# EAGLE design RobotBooster_mini_v1 (EAGLE 6.1)
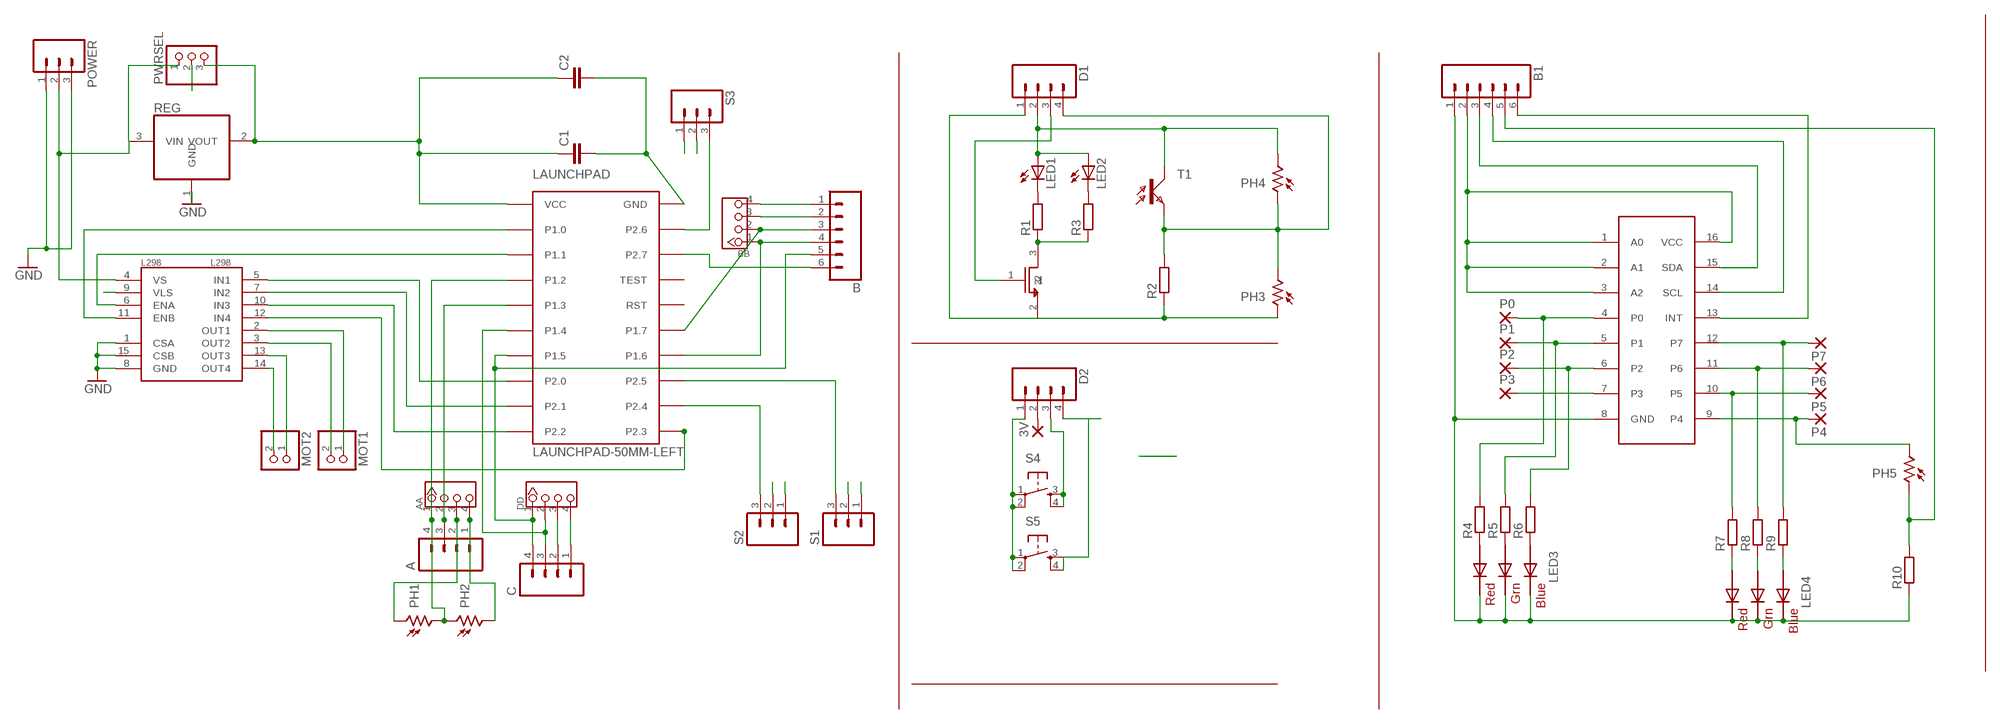
[diagram p0: schematic, sheet 1]

## Parts
3V  1,6/0,8  [1,6/0,8]
A  M04PTH  [1X04]
AA  TWIG-4P-2.0  [4P-2.0-W/O-BUCKLE]
B  M06SIP  [1X06]
B1  M06SIP  [1X06]
BB  TWIG-4P-2.0  [4P-2.0-W/O-BUCKLE]
C  M04PTH  [1X04]
C1  C-EU025-030X050  [C025-030X050]
C2  C-EUC1206  [C1206]
D1  M04PTH  [1X04]
D2  M04PTH  [1X04]
DD  TWIG-4P-2.0  [4P-2.0-W/O-BUCKLE]
FET  2N7002PW  [SOT323-R]
L298  L298  [MULTIWATT15]
LAUNCHPAD  LAUNCHPAD-50MM-LEFT  [LAUNCHPAD-50MM-LEFT]
LED1  LED5MM  [LED5MM]
LED2  LED5MM  [LED5MM]
LED3  RGBLED5050  [RGBLED5050]
LED4  RGBLED5050  [RGBLED5050]
MOT1  PINHD-1X2  [1X02]
MOT2  PINHD-1X2  [1X02]
P0  1,6/0,8  [1,6/0,8]
P1  1,6/0,8  [1,6/0,8]
P2  1,6/0,8  [1,6/0,8]
P3  1,6/0,8  [1,6/0,8]
P4  1,6/0,8  [1,6/0,8]
P5  1,6/0,8  [1,6/0,8]
P6  1,6/0,8  [1,6/0,8]
P7  1,6/0,8  [1,6/0,8]
PH1  M9960_11A  [M9960]
PH2  M9960_11A  [M9960]
PH3  M9960_11A  [M9960]
PH4  M9960_11A  [M9960]
PH5  M9960_11A  [M9960]
POWER  M03LONGPADS  [1X03_LONGPADS]
PWRSEL  PINHD-1X3  [1X03]
R1  R-EU_R1206  [R1206]
R2  R-EU_R1206  [R1206]
R3  R-EU_R1206  [R1206]
R4  R-EU_R0805  [R0805]
R5  R-EU_R0805  [R0805]
R6  R-EU_R0805  [R0805]
R7  R-EU_R0805  [R0805]
R8  R-EU_R0805  [R0805]
R9  R-EU_R0805  [R0805]
R10  R-EU_R0805  [R0805]
REG  REG1117  [SOT223]
S1  M03PTH  [1X03]
S2  M03PTH  [1X03]
S3  M03PTH  [1X03]
S4  TAC_SWITCHPTH  [TACTILE-PTH]
S5  TAC_SWITCHPTH  [TACTILE-PTH]
T1  LPT80A  [LPT80A]
U$1  PCA9534DBR  [SSOP16]

## Nets
GND: A.1 AA.4 B.1 BB.4 C1.2 C2.2 C.1 DD.4 L298.1(CSA) L298.8(GND) L298.15(CSB) LAUNCHPAD.GND PH2.2 POWER.1 POWER.3 REG.1(GND) S1.1 S2.1 S3.1
N$1: L298.14(OUT4) MOT2.2
N$2: L298.13(OUT3) MOT2.1
N$3: L298.3(OUT2) MOT1.2
N$4: L298.2(OUT1) MOT1.1
N$5: D1.1 FET.2 PH3.1 R2.1
N$6: FET.3 R1.1 R3.1
N$7: LED1.K(C) R1.2
N$8: A.4 AA.1 LAUNCHPAD.P1.2 PH1.2 PH2.1
N$9: L298.5(IN1) LAUNCHPAD.P2.0
N$10: C.3 DD.2 LAUNCHPAD.P1.4
N$11: D1.3 FET.1
N$12: D1.4 PH3.2 PH4.1 R2.2 T1.E
N$13: B.3 BB.2 LAUNCHPAD.P1.7
N$14: B.4 BB.1 LAUNCHPAD.P1.6
N$15: A.3 AA.2 LAUNCHPAD.P1.3
N$16: LAUNCHPAD.P2.4 S2.3
N$17: LAUNCHPAD.P2.5 S1.3
N$18: B.5 C.4 DD.1 LAUNCHPAD.P1.5
N$19: D1.2 LED1.A LED2.A PH4.2 T1.C
N$20: LED2.K(C) R3.2
N$21: P6.1(P) R8.2 U$1.11(P6)
N$22: P3.1(P) U$1.7(P3)
N$23: B.6 LAUNCHPAD.P2.7
N$24: D2.1 S4.1 S4.2 S5.1 S5.2
N$25: 3V.1(P) D2.2
N$26: LAUNCHPAD.P2.6 S3.3
N$27: D2.3 S4.3 S4.4
N$28: D2.4 S5.3 S5.4
N$32: B1.2 U$1.1(A0) U$1.2(A1) U$1.3(A2) U$1.16(VCC)
N$33: B1.1 LED3.4(BLUE_C) LED3.5(RED_C) LED3.6(GREEN_C) LED4.4(BLUE_C) LED4.5(RED_C) LED4.6(GREEN_C) R10.1 U$1.8(GND)
N$34: B1.3 U$1.15(SDA)
N$35: B1.4 U$1.14(SCL)
N$36: P7.1(P) R9.2 U$1.12(P7)
N$39: LED3.2(RED_A) R4.1
N$40: LED3.1(GREEN_A) R5.1
N$41: LED3.3(BLUE_A) R6.1
N$42: B1.6 U$1.13(INT)
N$45: LED4.2(RED_A) R7.1
N$46: LED4.1(GREEN_A) R8.1
N$47: LED4.3(BLUE_A) R9.1
N$49: P0.1(P) R4.2 U$1.4(P0)
N$50: P1.1(P) R5.2 U$1.5(P1)
N$51: P2.1(P) R6.2 U$1.6(P2)
N$52: B1.5 PH5.1 R10.2
N$53: P4.1(P) PH5.2 U$1.9(P4)
N$54: P5.1(P) R7.2 U$1.10(P5)
P1.0: L298.11(ENB) LAUNCHPAD.P1.0
P1.1: L298.6(ENA) LAUNCHPAD.P1.1
P1.3: L298.7(IN2) LAUNCHPAD.P2.1
P1.4: L298.10(IN3) LAUNCHPAD.P2.2
P1.5: L298.12(IN4) LAUNCHPAD.P2.3
VBAT: L298.4(VS) POWER.2 PWRSEL.1 REG.3(VIN)
VCC: A.2 AA.3 B.2 BB.3 C1.1 C2.1 C.2 DD.3 L298.9(VLS) LAUNCHPAD.VCC PH1.1 PWRSEL.3 REG.2(VOUT)
VSERV: PWRSEL.2 S1.2 S2.2 S3.2
Unconnected: LAUNCHPAD.RST LAUNCHPAD.TEST

## Library data of the parts
3V P0 P1-P7 = wirepad:1,6/0,8: THROUGH-HOLE PAD
A C D1 D2 = SparkFun-Connectors:M04: Header 4 Standard 4-pin 0.1" header. Use with straight break away headers (SKU : PRT-00116), right angle break away headers (PRT-00553), swiss pins (PRT-00743), machine pins (PRT-00117), and female headers (PRT-00115). Molex polarized connector foot print use with SKU : PRT-08231 with associated crimp pins and housings. 1MM SMD Version SKU: PRT-10208
AA BB DD = Connector:TWIG-4P-2.0
B B1 = SparkFun-Connectors:M06: Header 6 Standard 6-pin 0.1" header. Use with straight break away headers (SKU : PRT-00116), right angle break away headers (PRT-00553), swiss pins (PRT-00743), machine pins (PRT-00117), and female headers (PRT-00115). Molex polarized connector foot print use with SKU : PRT-08094 with associated crimp pins and housings. NOTES ON THE VARIANTS LOCK and LOCK_LONGPADS... This footprint was designed to help hold the alignment of a through-hole component (i.e. 6-pin header) while soldering it into place. You may notice that each hole has been shifted either up or down by 0.005 of an inch from it's more standard position (which is a perfectly straight line). This slight alteration caused the pins (the squares in the middle) to touch the edges of the holes. Because they are alternating, it causes a "brace" to hold the component in place. 0.005 has proven to be the perfect amount of "off-center" position when using our standard breakaway headers. Although looks a little odd when you look at the bare footprint, once you have a header in there, the alteration is very hard to notice. Also, if you push a header all the way into place, it is covered up entirely on the bottom side. This idea of altering the position of holes to aid alignment will be further integrated into the Sparkfun Library for other footprints. It can help hold any component with 3 or more connection pins.
C1 C2 = resistor:C-EU: CAPACITOR, European symbol
FET = apus-spidisplay:2N7002PW
L298 = SparkFun-PowerIC:L298: L298 Dual Full Bridge Driver
LAUNCHPAD = TI_launchpad:LAUNCHPAD: MSP-EXP430G2 LaunchPad Booster Pack layouts. LAUNCHPAD: Full-size board LAUNCHPAD-50MM: 50x50mm board covering the button area LAUNCHPAD-50MM-LEFT: 50x50mm board leaving the button area open. Tall LaunchPad components marked on Reference for reference.
LED1 LED2 = adafruit:LED: LED OSRAM: - CHIPLED LG R971, LG N971, LY N971, LG Q971, LY Q971, LO R971, LY R971 LH N974, LH R974 LS Q976, LO Q976, LY Q976 LO Q996 - Hyper CHIPLED LW Q18S LB Q993, LB Q99A, LB R99A - SideLED LS A670, LO A670, LY A670, LG A670, LP A670 LB A673, LV A673, LT A673, LW A673 LH A674 LY A675 LS A676, LA A676, LO A676, LY A676, LW A676 LS A679, LY A679, LG A679 - Hyper Micro SIDELED® LS Y876, LA Y876, LO Y876, LY Y876 LT Y87S - SmartLED LW L88C, LW L88S LB L89C, LB L89S, LG L890 LS L89K, LO L89K, LY L89K LS L896, LA L896, LO L896, LY L896 - TOPLED LS T670, LO T670, LY T670, LG T670, LP T670 LSG T670, LSP T670, LSY T670, LOP T670, LYG T670 LG T671, LOG T671, LSG T671 LB T673, LV T673, LT T673, LW T673 LH T674 LS T676, LA T676, LO T676, LY T676, LB T676, LH T676, LSB T676, LW T676 LB T67C, LV T67C, LT T67C, LS T67K, LO T67K, LY T67K, LW E67C LS E67B, LA E67B, LO E67B, LY E67B, LB E67C, LV E67C, LT E67C LW T67C LS T679, LY T679, LG T679 LS T770, LO T770, LY T770, LG T770, LP T770 LB T773, LV T773, LT T773, LW T773 LH T774 LS E675, LA E675, LY E675, LS T675 LS T776, LA T776, LO T776, LY T776, LB T776 LHGB T686 LT T68C, LB T68C - Hyper Mini TOPLED® LB M676 - Mini TOPLED Santana® LG M470 LS M47K, LO M47K, LY M47K Source: http://www.osram.convergy.de/
LED3 LED4 = adafruit:RGBLED: For 5050 RGB LEDs, the order of the LEDs may vary from one manufacturer to another!
MOT1 MOT2 = pinhead:PINHD-1X2: PIN HEADER
PH1-PH5 = photo-elements:M9960_11: Photo Sensor Beacon Light, Photometer Applications Source: http://optoelectronics.perkinelmer.com/content/Datasheets/DTS_M9960.pdf
POWER S1-S3 = SparkFun-Connectors:M03: Header 3 Standard 3-pin 0.1" header. Use with straight break away headers (SKU : PRT-00116), right angle break away headers (PRT-00553), swiss pins (PRT-00743), machine pins (PRT-00117), and female headers (PRT-00115). Molex polarized connector foot print use with SKU : PRT-08232 with associated crimp pins and housings.
PWRSEL = adafruit:PINHD-1X3: PIN HEADER
R1-R10 = resistor:R-EU_: RESISTOR, European symbol
REG = burr-brown:REG1117: 800mA and 1A Low Dropout (LDO) Positive Regulator 1.8V, 2.5V, 2.85V, 3.3V, 5V, and Adj; MPN: REG1117; OC_FARNELL: 1097566; OC_NEWARK: 14P6981
S4 S5 = SparkFun-Electromechanical:TAC_SWITCH: Momentary Switch Button commonly used for reset or general input. Spark Fun Electronics SKU : COM-00097
T1 = opto-trans-siemens:LPT80A: PHOTO TRANSISTOR; OC_FARNELL: unknown; OC_NEWARK: unknown
U$1 = apus-spidisplay:PCA9534DBR

## Board
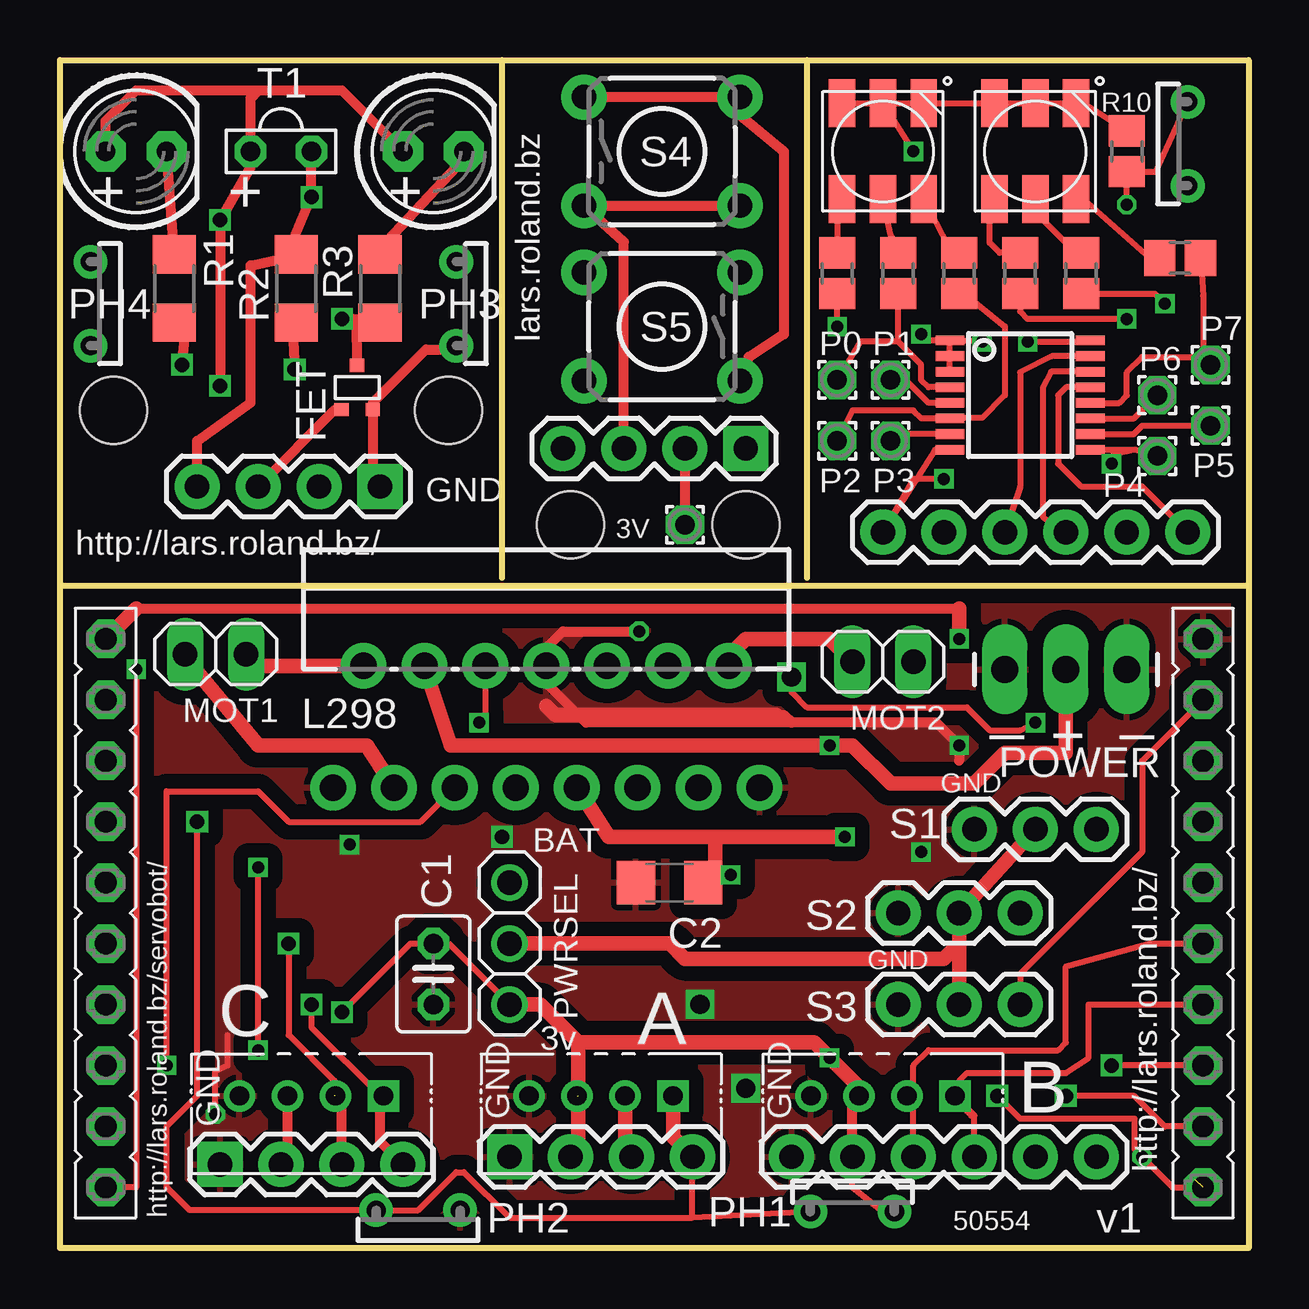
[diagram p1: board, top side]
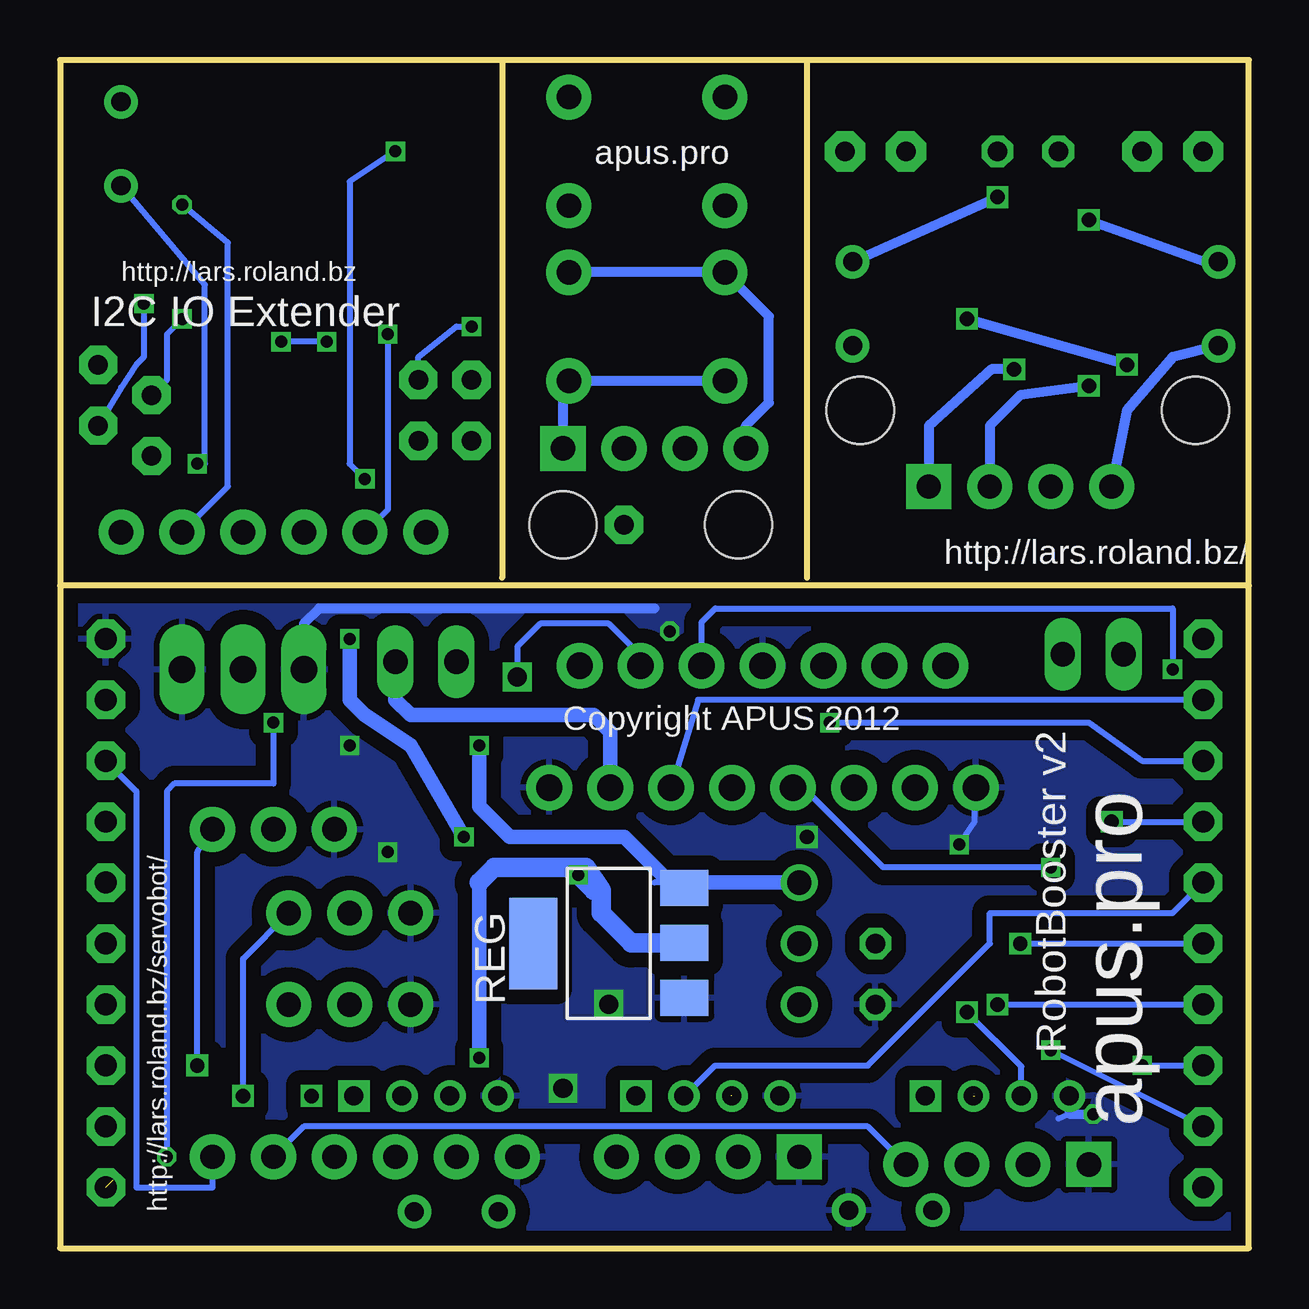
[diagram p2: board, bottom side, seen from below]

Size 49.54 x 49.56 mm. Coordinates in mm from the lower left corner, seen from the top.
Outline: 18.41,49.56 18.41,27.97
Outline: 0,27.65 49.53,27.65
Outline: 0,27.65 0,49.56 31.11,49.56
Outline: 31.11,49.56 49.53,49.56 49.53,27.65
Outline: 49.53,27.65 49.53,0.03 0,0.03 0,27.65
Outline: 31.11,49.56 31.11,27.97
Outline: 0,0 49.54,0 49.54,27.58 0,27.58 0,0
Copper layers (1*16): Top 0.035mm / dielectric 1.5mm / Bottom 0.035mm
Design rules: minimum track width 6mil, minimum drill 12mil, track to track 6mil, track to pad 6mil, pad to pad 6mil, via to via 6mil, smd to smd 0mil, copper to edge 10mil, drill to drill 10mil, minimum pad ring 10mil, minimum via ring 6mil, stop-mask expansion 2mil, vias tented up to drill 100mil, thermal gap 10mil
Holes 2.8 mm at 2.22,34.95 16.19,34.95 21.27,30.19 28.57,30.19

### Footprints (pad centres in the part's own frame; a part is rotated, then mirrored left to right if it is on the bottom)
1,6/0,8 = drill 0.813 pad 1.6 octagon: 1 0,0
1X04 = drill 1.016 pad 1.88 square: 1 0,0 | drill 1.016 pad 1.88: 2 2.54,0; 3 5.08,0; 4 7.62,0
4P-2.0-W/O-BUCKLE = drill 0.8 pad 1.27 square: 1 -3,0 | drill 0.8 pad 1.27: 2 -1,0; 3 1,0; 4 3,0
1X06 = drill 1.016 pad 1.88: 1 0,0; 2 2.54,0; 3 5.08,0; 4 7.62,0; 5 10.16,0; 6 12.7,0
C025-030X050 = drill 0.813 octagon: 1 -1.27,0; 2 1.27,0
C1206 = smd 1.6 x 1.8: 1 -1.4,0; 2 1.4,0
SOT323-R = smd 0.6 x 0.55: 1 -0.65,-0.925; 2 0.65,-0.925; 3 0,0.925
MULTIWATT15 = drill 1.1 pad 1.9: 1 -8.95,-2.39; 2 -7.68,2.69; 3 -6.41,-2.39; 4 -5.14,2.69; 5 -3.87,-2.39; 6 -2.6,2.69; 7 -1.33,-2.39; 8 -0.06,2.69; 9 1.21,-2.39; 10 2.48,2.69; 11 3.75,-2.39; 12 5.02,2.69; 13 6.29,-2.39; 14 7.56,2.69; 15 8.83,-2.39
LAUNCHPAD-50MM-LEFT = drill 0.914 pad 1.6 octagon: GND 24.13,48.26; P1.0 26.67,2.54; P1.1 29.21,2.54; P1.2 31.75,2.54; P1.3 34.29,2.54; P1.4 36.83,2.54; P1.5 39.37,2.54; P1.6 39.37,48.26; P1.7 36.83,48.26; P2.0 41.91,2.54; P2.1 44.45,2.54; P2.2 46.99,2.54; P2.3 46.99,48.26; P2.4 44.45,48.26; P2.5 41.91,48.26; P2.6 26.67,48.26; P2.7 29.21,48.26; RST 34.29,48.26; TEST 31.75,48.26; VCC 24.13,2.54
LED5MM = drill 0.813 pad 1.676 octagon: A -1.27,0; K 1.27,0
RGBLED5050 = smd 2 x 1.1: 1 -2,1.7; 2 -2,0; 3 -2,-1.7; 4 2,-1.7; 5 2,0; 6 2,1.7
1X02 = drill 1.016 long: 1 -1.27,0; 2 1.27,0
M9960 = drill 0.8 pad 1.4: 1 -1.75,0; 2 1.75,0
1X03_LONGPADS = drill 1.118 pad 1.88 long: 1 0,0; 2 2.54,0; 3 5.08,0
1X03 = drill 1.016: 1 -2.54,0; 2 0,0; 3 2.54,0
R1206 = smd 1.6 x 1.803: 1 -1.422,0; 2 1.422,0
R0805 = smd 1.3 x 1.5: 1 -0.85,0; 2 0.85,0
SOT223 = smd 1.499 x 2.007: 1 -2.261,-3.15; 2 0.025,-3.15; 3 2.311,-3.15 | smd 3.81 x 2.007: 4 0,3.15
1X03' = drill 1.016 pad 1.88: 1 0,0; 2 2.54,0; 3 5.08,0
TACTILE-PTH = drill 1.016 pad 1.88: 1 -3.251,2.261; 2 3.251,2.261; 3 -3.251,-2.261; 4 3.251,-2.261
LPT80A = drill 0.813 octagon: C 0,-1.27; E 0,1.27
SSOP16 = smd 0.4 x 1.2: 1 -2.275,-2.925; 2 -1.625,-2.925; 3 -0.975,-2.925; 4 -0.325,-2.925; 5 0.325,-2.925; 6 0.975,-2.925; 7 1.625,-2.925; 8 2.275,-2.925; 9 2.275,2.925; 10 1.625,2.925; 11 0.975,2.925; 12 0.325,2.925; 13 -0.325,2.925; 14 -0.975,2.925; 15 -1.625,2.925; 16 -2.275,2.925

### Placement (x,y rotation side)
3V  26.04,30.19 0 top
A  18.73,3.84 0 top
AA  22.54,6.38 180 top
B  30.48,3.84 0 top
B1  34.29,29.88 0 top
BB  34.29,6.38 180 top
C  6.67,3.52 0 top
C1  15.56,11.46 270 top
C2  25.4,15.27 180 top
D1  13.34,31.78 180 top
D2  28.57,33.37 180 top
DD  10.48,6.38 180 top
FET  12.38,35.91 0 top
L298  20.32,21.62 0 top
LAUNCHPAD  -0.64,49.56 270 top
LED1  3.17,45.75 0 top
LED2  15.56,45.75 0 top
LED3  34.29,45.75 90 top
LED4  40.64,45.75 90 top
MOT1  6.49,24.8 180 top
MOT2  34.29,24.48 180 top
P0  32.39,36.23 0 top
P1  34.61,36.23 0 top
P2  32.39,33.69 0 top
P3  34.61,33.69 0 top
P4  45.72,33.05 0 top
P5  47.94,34.32 0 top
P6  45.72,35.59 0 top
P7  47.94,36.86 0 top
PH1  33.02,1.55 180 top
PH2  14.92,1.62 0 top
PH3  16.51,39.4 90 top
PH4  1.27,39.4 90 top
PH5  46.99,46.07 270 top
POWER  39.37,24.16 0 top
PWRSEL  18.73,12.73 270 top
R1  4.76,40.04 90 top
R2  9.84,40.04 90 top
R3  13.34,40.04 90 top
R4  34.93,40.67 270 top
R5  32.39,40.67 270 top
R6  37.47,40.67 270 top
R7  42.55,40.67 270 top
R8  40.01,40.67 270 top
R9  46.67,41.3 0 top
R10  44.45,45.75 270 top
REG  26.67,12.73 90 bottom
S1  [1X03']  38.1,17.49 0 top
S2  [1X03']  34.93,14 0 top
S3  [1X03']  34.93,10.19 0 top
S4  25.08,45.75 0 top
S5  25.08,38.45 180 top
T1  9.21,45.75 270 top
U$1  40.01,35.59 270 top

### Tracks (layer width: path | path; a pad name or v marks a point on that pad's centre or on a via)
GND  (via drill 0.5, 0.6, 0.8)
  Top 0.254: v6.48,5.62 6.48,7.4 6.99,7.65 6.99,8.92
  Top 0.406: 29.84,22.26 30.16,22.26 30.48,21.94 | 37.47,20.35 v37.47,20.98 36.51,21.94 21.91,21.94 20.32,23.53 20.32,25.11 20.95,25.75 v24.13,25.75
  Top 0.61: 20.26,22.63 20.64,22.26 29.84,22.26
  Bottom 0.254: v12.06,16.86 11.43,17.81 11.43,18.66 L298.1 | 7.48,5.63 7.94,5.43
  Bottom 0.406: DD.4 7.48,5.63 v6.48,5.62 | 24.76,26.7 38.73,26.7 39.37,26.07 POWER.1
  Bottom 0.61: S1.1 38.42,17.49 | 40.01,23.53 POWER.1
  other vias: 18.41,17.18 35.88,16.54 28.57,6.7 26.67,10.19
  pour Bottom (isolate 0.61): 0.95,27.65 49.21,27.65 48.9,0.03 0.64,0.03
  pour Top (isolate 0.61): 0.64,27.65 48.9,27.65 48.9,0.03 0.64,0.03
N$1
  Top 0.61: L298.14 27.88,24.73 28.57,25.43 32.07,25.43 MOT2.2
N$2
  Bottom 0.61: L298.13 26.61,21.56 27.3,22.26 34.93,22.26 35.56,22.89 MOT2.1
N$3
  Top 0.61: MOT1.2 5.21,24.66 8.26,20.98 12.79,20.98 L298.3
N$4
  Top 0.61: L298.2 8.24,24.31 MOT1.1
N$5  (via drill 0.6)
  Top 0.406: R2.1 9.68,38.61 v9.78,36.67 | D1.1 13.03,32.08 FET.2 13.03,35.29 15.24,37.5 16.35,37.5 PH3.1
  Bottom 0.406: v9.78,36.67 10.73,36.67 13.34,34.32 D1.1
N$6  (via drill 0.6)
  Top 0.406: FET.3 12.36,38.74 v11.75,38.77 11.91,38.77 | 11.91,38.77 12.22,38.77 R3.1 11.91,38.77 | R1.1 5.23,38.61 v5.08,36.86
  Bottom 0.406: v5.08,36.86 v11.75,38.77
N$7
  Top 0.406: R1.2 LED1.K
N$8  (via drill 0.6)
  Top 0.254: PH1.2 26.35,1.3 | 26.35,1.3 A.4 | 26.35,1.3 18.73,1.3 16.83,3.2 16.51,3.2 14.92,1.62 PH2.1 5.4,1.62 4.45,2.57 4.45,5.11 5.71,6.38 v5.71,17.81
  Top 0.61: A.4 25.54,4.65 AA.1
  Bottom 0.254: v5.71,17.81 LAUNCHPAD.P1.2
N$9  (via drill 0.5)
  Top 0.254: v4.45,7.65 4.45,19.08 8.26,19.08 9.53,17.81 15.03,17.81 L298.5
  Bottom 0.254: v4.45,7.65 LAUNCHPAD.P2.0
N$10  (via drill 0.6)  (1 unrouted)
  Top 0.254: v9.53,12.73 9.53,8.92 11.43,7.02 11.43,6.38
  Top 0.406: C.3 11.75,6.11 DD.2
  Bottom 0.254: v9.53,12.73 LAUNCHPAD.P1.4
N$11
  Top 0.406: FET.1 11.46,34.98 D1.3
N$12  (via drill 0.6)
  Top 0.406: D1.4 5.71,33.69 7.94,35.27 7.94,40.99 9.36,41.3 R2.2 9.53,41.62 v10.48,43.84 T1.E
  Bottom 0.406: PH4.1 3.17,37.18 5.08,34.95 D1.4 | PH3.2 v10.48,43.84
N$13
  Top 0.254: B.3 35.56,6.11 | 35.56,6.11 BB.2 | 35.56,6.11 35.56,7.65 36.2,8.29 41.59,8.29 41.91,8.6 41.91,11.78 45.4,12.73 LAUNCHPAD.P1.7
N$14
  Top 0.254: B.4 38.1,5.57 | 38.1,5.57 BB.1 | 38.1,5.57 37.96,5.57 37.15,6.38 37.15,6.7 37.78,7.33 41.91,7.33 42.86,7.97 42.86,10.19 LAUNCHPAD.P1.6
N$15
  Top 0.61: A.3 23.54,4.11 AA.2
  Bottom 0.254: AA.2 23.49,6.38 22.22,7.65 15.88,7.65 10.79,12.73 10.79,14 3.17,14 LAUNCHPAD.P1.3
N$16  (via drill 0.6)
  Top 0.254: LAUNCHPAD.P2.4 46.04,5.11 44.77,6.38 v41.91,6.38
  Bottom 0.254: v41.91,6.38 41.91,12.09 S2.3
N$17  (via drill 0.6)
  Top 0.254: LAUNCHPAD.P2.5 v43.82,7.65
  Bottom 0.254: v43.82,7.65 43.82,16.54 S1.3
N$18  (via drill 0.6)
  Top 0.254: v10.48,10.19 10.48,9.24 13.34,6.38 | DD.1 13.34,6.38 | 13.34,6.38 13.34,6.24
  Top 0.406: C.4 13.34,4.48 13.34,6.24
  Bottom 0.254: v10.48,10.19 LAUNCHPAD.P1.5 | C.4 15.88,5.11 39.37,5.11 B.5
N$19  (via drill 0.6)
  Top 0.406: LED1.A 1.91,47.02 3.17,48.29 8.26,48.29 | 8.26,48.29 11.75,48.29 LED2.A | 8.26,48.29 7.94,47.97 T1.C 7.94,45.12 v6.67,42.89 v6.67,35.97
  Bottom 0.406: v6.67,35.97 9.53,35.59 10.79,34.32 D1.2 | v6.67,42.89 1.77,41.13 | 1.77,41.13 1.27,40.99 | PH4.2 1.77,41.13
N$20
  Top 0.406: LED2.K 16.83,45.43 13.34,41.69 13.31,41.43 R3.2
N$21  (via drill 0.5)
  Top 0.254: U$1.11 44.75,34.62 P6.1 | R8.2 40.01,39.08 40.32,38.77 v44.45,38.77
  Bottom 0.254: v44.45,38.77 45.09,38.13 45.09,36.23 P6.1 46.36,35.59
N$22
  Top 0.254: U$1.7 35.28,33.97 P3.1
N$23
  Bottom 0.254: LAUNCHPAD.P2.7 46.36,19.08 46.36,2.57 43.18,2.57 B.6
N$24
  Top 0.406: S4.1 S4.2 28.33,47.26 30.16,45.75 30.16,38.13 28.69,37.18 S5.1
  Bottom 0.406: D2.1 28.57,35.95 S5.1 S5.2
N$25
  Top 0.406: D2.2 3V.1
N$26
  Top 0.254: LAUNCHPAD.P2.6 45.09,20.35 45.09,16.54 40.01,11.46 S3.3
N$27
  Top 0.406: D2.3 23.49,41.98 S4.3 S4.4
N$28
  Bottom 0.406: D2.4 20.95,34.32 20,35.27 20,38.88 S5.4 S5.3
N$32  (via drill 0.5)
  Top 0.254: U$1.3 U$1.2 U$1.1 | U$1.1 36.14,37.87 v35.88,38.13 | U$1.1 38.05,37.87 v38.42,37.81 | v40.32,37.81 42.88,37.81 U$1.16
  Bottom 0.254: v35.88,38.13 35.88,30.83 B1.2 | v38.42,37.81 v40.32,37.81
N$33  (via drill 0.5)
  Top 0.254: LED3.6 LED3.5 | LED3.5 LED3.4 LED4.6 LED4.5 LED4.4 | U$1.8 36.46,33.31 B1.1 35.56,32.1 v36.83,32.1 | LED3.5 v35.56,45.75 | 42.62,47.47 LED4.4 | R10.1 42.46,47.87 LED4.4
  Bottom 0.254: v35.56,45.75 37.47,44.48 37.47,32.73 v36.83,32.1
N$34
  Top 0.254: U$1.15 41.31,37.22 40.01,36.54 40.01,31.78 B1.3
N$35
  Top 0.254: U$1.14 41.3,36.56 40.96,35.91 40.96,30.51 B1.4
N$36
  Top 0.254: R9.2 47.62,39.72 47.62,36.86 P7.1 47.62,37.18 45.09,37.18 44.45,36.54 44.45,35.59 44.12,35.27 U$1.12
N$39
  Top 0.254: R4.1 35.14,41.52 34.61,42.26 LED3.2
N$40
  Top 0.254: LED3.1 32.29,43.75 32.39,43.21 R5.1
N$41
  Top 0.254: LED3.3 37.26,41.31 R6.1
N$42
  Top 0.254: U$1.13 41.92,35.91 41.59,35.59 41.59,32.73 42.55,31.78 45.09,31.78 B1.6
N$45
  Top 0.254: LED4.2 40.64,43.21 41.91,41.94 42.12,41.94 R7.1
N$46
  Top 0.254: R8.1 39.16,41.52 38.73,41.94 38.73,43.21 38.94,43.41 LED4.1
N$47
  Top 0.254: LED4.3 42.64,43.75 45.4,41.3 45.4,41.09 R9.1
N$49
  Top 0.254: U$1.4 36.19,35.91 35.88,36.23 35.88,36.86 34.93,37.81 | 34.93,37.81 33.34,37.81 P0.1 | 34.93,37.81 R4.2
N$50  (via drill 0.5)
  Top 0.254: U$1.5 36.2,35.27 35.24,36.23 P1.1 | v32.39,38.45 R5.2
  Bottom 0.254: P1.1 34.61,37.18 33.02,38.45 v32.39,38.45
N$51
  Top 0.254: 37.25,39.82 R6.2 37.68,39.82 39.37,38.45 39.37,35.59 38.42,34.64 37.1,34.64 U$1.6 35.9,34.62 35.56,34.95 33.02,34.95 P2.1
N$52  (via drill 0.5)
  Top 0.254: 46.99,47.52 PH5.1 45.66,44.9 R10.2 v44.45,43.53
  Bottom 0.254: B1.5 42.55,31.78 42.55,41.94 v44.45,43.53
N$53  (via drill 0.5)
  Top 0.254: U$1.9 44.82,33.31 | 44.82,33.31 P4.1 | 44.82,33.31 43.87,33.1 v43.82,32.73
  Bottom 0.254: v43.82,32.73 43.5,32.73 43.5,40.19 PH5.2
N$54  (via drill 0.5)
  Top 0.254: U$1.10 44.73,33.97 45.09,34.32 P5.1 | R7.2 45.62,39.82 v46.04,39.4
  Bottom 0.254: v46.04,39.4 46.04,37.18 46.36,36.86 46.99,35.91 P5.1
P1.0
  Bottom 0.254: LAUNCHPAD.P1.0 22.95,22.89 L298.11
P1.1  (via drill 0.5)
  Top 0.254: L298.6 17.72,22 v17.46,21.94
  Bottom 0.254: v17.46,21.94 6.67,21.94 4.45,20.35 LAUNCHPAD.P1.1
P1.3  (via drill 0.5)
  Top 0.254: v8.26,8.29 v8.26,15.9
  Bottom 0.254: LAUNCHPAD.P2.1 v8.26,8.29 | v8.26,15.9 15.24,15.9 18.56,19.23 L298.7
P1.4  (via drill 0.5)
  Top 0.254: v3.17,24.16 3.17,2.57 LAUNCHPAD.P2.2
  Bottom 0.254: L298.10 22.8,26.12 22.22,26.7 3.17,26.7 v3.17,24.16
P1.5  (via drill 0.5, 0.6, 0.8)  (1 unrouted)
  Top 0.254: v39.05,6.38 40.01,5.43 44.77,5.43 44.77,4.16 v45.09,3.84 46.36,2.57 LAUNCHPAD.P2.3 | v40.64,21.94 40.01,21.62 38.73,21.62 37.78,22.57 31.11,22.57 30.48,23.21 v30.48,23.84
  Bottom 0.254: 46.99,2.89 47.31,2.89 | L298.12 25.34,24.73 26.67,26.07 29.53,26.07 30.48,25.11 v30.48,23.84 | v40.64,21.94 40.64,19.4 44.77,19.4 45.09,19.08 v45.09,3.84
VBAT  (via drill 0.5)
  Top 0.61: L298.4 16.28,20.98 v32.07,20.98 33.02,20.98 34.61,19.4 38.1,19.4 39.37,20.67 41.91,20.67 POWER.2
  Bottom 0.254: REG.3 23.52,15.24 23.49,15.27 | 24.13,15.27 24.76,15.27
  Bottom 0.61: PWRSEL.1 23.49,15.27 24.13,15.27 26.04,17.18 30.8,17.18 32.07,18.45 v32.07,20.98
VCC  (via drill 0.5, 0.6)  (1 unrouted)
  Top 0.254: PWRSEL.3 16.19,12.73 C1.1 14.61,12.73 v11.75,9.87 | PH1.1 34.29,1.55 33.02,2.57 B.2 | 33.34,6.38 BB.3 33.66,6.38
  Top 0.406: 3.17,26.7 37.47,26.7 | B.2 33.02,6.06 33.34,6.38 | DD.3 9.48,3.89 9.53,3.84 C.2
  Top 0.61: C2.1 26.99,15.27 27.3,15.27 27.3,17.18 | 27.3,17.18 22.86,17.18 21.59,19.17 | 21.59,19.17 L298.9 21.68,19.08 21.59,19.08 21.59,19.17 | LAUNCHPAD.VCC 3.17,26.7 | 27.3,17.18 v32.7,17.18 | v37.47,25.43 37.47,26.7 | AA.3 21.59,6.43 21.59,8.6 | PWRSEL.3 20,10.19 21.59,8.6 | A.2 21.59,4.16 21.59,6.38 | 33.66,6.38 v32.07,7.97 31.43,8.6 21.59,8.6 | 33.34,6.38 33.34,6.7
  Top 0.813: v27.94,15.59 27.3,15.59 26.99,15.27
  Bottom 0.254: DD.3 9.48,7.6 v11.75,9.87
  Bottom 0.61: 21.59,19.17 L298.9 | 32.07,15.27 v32.07,7.97 | v37.47,25.43 37.47,22.89 36.83,22.26 34.93,20.98 v32.7,17.18
  Bottom 0.813: REG.2 25.74,12.75 26.99,14 26.99,14.95 | 26.99,14.95 27.62,15.9 31.43,15.9 32.07,15.27 | 26.99,14.95 27.3,14.95 v27.94,15.59
VSERV
  Top 0.61: PWRSEL.2 25.4,12.73 26.04,12.09 36.83,12.09 37.47,12.73 | S1.2 S2.2 37.47,12.73 | 37.47,12.73 S3.2

### Text on the board
tPlace: + | + | + | lars.roland.bz | GND | http://lars.roland.bz/ | _ | _ | + | GND | BAT | GND | 3v | GND | GND | GND | http://lars.roland.bz/ | http://lars.roland.bz/servobot/ | 50554 | v1
bPlace: apus.pro | http://lars.roland.bz | I2C IO Extender | http://lars.roland.bz/ | RobotBooster v2 | Copyright APUS 2012 | apus.pro | http://lars.roland.bz/servobot/